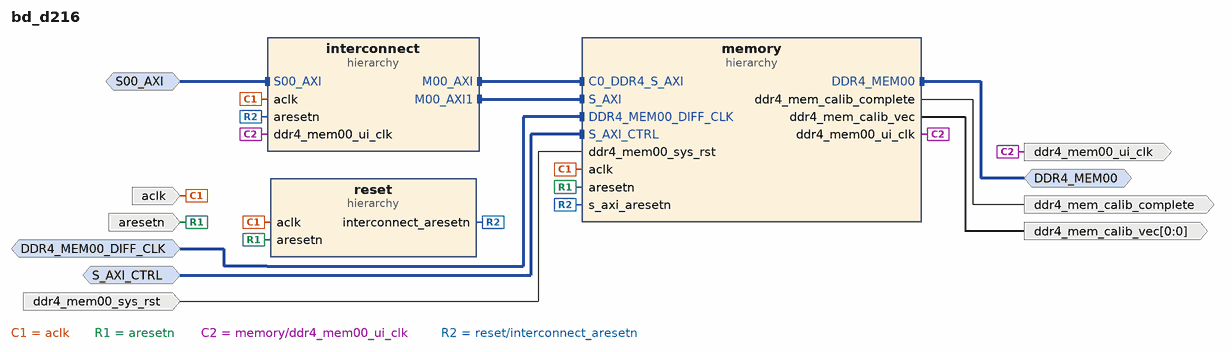
[diagram p0: block diagram of the top level]
# Vivado block design bd_d216, xcku15p-ffva1156-2LV-e, Vivado 2021.1
create_bd_design bd_d216

create_bd_intf_port -mode Slave -vlnv xilinx.com:interface:aximm_rtl:1.0 S_AXI_CTRL
set_property -dict {CONFIG.PROTOCOL AXI4LITE} [get_bd_intf_ports S_AXI_CTRL]
create_bd_intf_port -mode Slave -vlnv xilinx.com:interface:aximm_rtl:1.0 S00_AXI
set_property -dict [list \
  CONFIG.ADDR_WIDTH 35 \
  CONFIG.NUM_READ_OUTSTANDING 2 \
  CONFIG.NUM_WRITE_OUTSTANDING 2 \
  CONFIG.master_id 1 \
] [get_bd_intf_ports S00_AXI]
create_bd_intf_port -mode Master -vlnv xilinx.com:interface:ddr4_rtl:1.0 DDR4_MEM00
create_bd_intf_port -mode Slave -vlnv xilinx.com:interface:diff_clock_rtl:1.0 DDR4_MEM00_DIFF_CLK
set_property -dict {CONFIG.FREQ_HZ 100000000} [get_bd_intf_ports DDR4_MEM00_DIFF_CLK]
create_bd_port -dir I -type clk aclk
set_property -dict {CONFIG.ASSOCIATED_BUSIF S00_AXI:S_AXI_CTRL} [get_bd_ports aclk]
create_bd_port -dir I -type rst aresetn
create_bd_port -dir O -type clk ddr4_mem00_ui_clk
set_property -dict {CONFIG.FREQ_HZ 300000000} [get_bd_ports ddr4_mem00_ui_clk]
create_bd_port -dir I -type rst ddr4_mem00_sys_rst
set_property -dict {CONFIG.POLARITY ACTIVE_HIGH} [get_bd_ports ddr4_mem00_sys_rst]
create_bd_port -dir O -type data ddr4_mem_calib_complete
create_bd_port -dir O -from 0 -to 0 -type data ddr4_mem_calib_vec

create_bd_cell -type hier reset
create_bd_cell -type hier interconnect
create_bd_cell -type hier memory

# ---- hierarchy /reset ----
current_bd_instance /reset
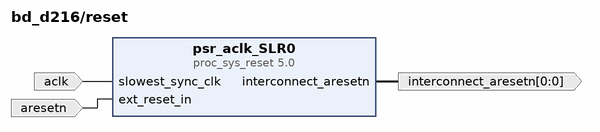
[diagram p1: block diagram inside /reset]
create_bd_pin -dir I -type clk aclk
create_bd_pin -dir I -type rst aresetn
create_bd_pin -dir O -from 0 -to 0 -type rst interconnect_aresetn

create_bd_cell -type ip -vlnv xilinx.com:ip:proc_sys_reset:5.0 psr_aclk_SLR0
set_property -dict {CONFIG.SLR_ASSIGNMENTS SLR0} [get_bd_cells psr_aclk_SLR0]

# ---- hierarchy /interconnect ----
current_bd_instance /interconnect
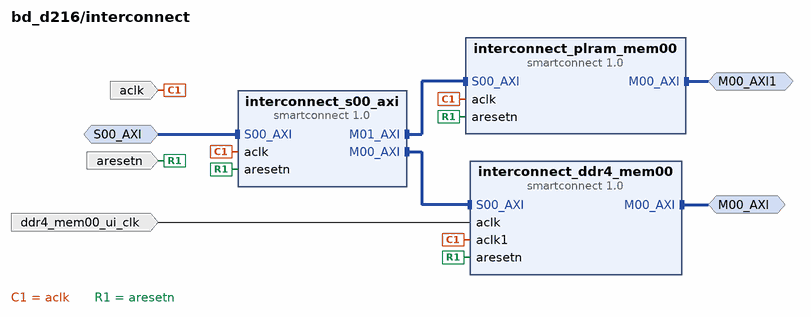
[diagram p2: block diagram inside /interconnect]
create_bd_intf_pin -mode Slave -vlnv xilinx.com:interface:aximm_rtl:1.0 S00_AXI
create_bd_intf_pin -mode Master -vlnv xilinx.com:interface:aximm_rtl:1.0 M00_AXI
create_bd_intf_pin -mode Master -vlnv xilinx.com:interface:aximm_rtl:1.0 M00_AXI1
create_bd_pin -dir I -type clk aclk
create_bd_pin -dir I -type rst aresetn
create_bd_pin -dir I -type clk ddr4_mem00_ui_clk

create_bd_cell -type ip -vlnv xilinx.com:ip:smartconnect:1.0 interconnect_s00_axi
set_property -dict [list \
  CONFIG.ADVANCED_PROPERTIES {__view__ {functional {S00_Buffer {R_SIZE 512 W_SIZE 512} S00_Entry {PKT_R_THR 512 LIM_R_LEN 256 PKT_W_THR 64 LIM_W_LEN 256}}}} \
  CONFIG.NUM_MI 2 \
  CONFIG.NUM_SI 1 \
] [get_bd_cells interconnect_s00_axi]
create_bd_cell -type ip -vlnv xilinx.com:ip:smartconnect:1.0 interconnect_ddr4_mem00
set_property -dict {CONFIG.NUM_CLKS 2 CONFIG.NUM_SI 1} [get_bd_cells interconnect_ddr4_mem00]
create_bd_cell -type ip -vlnv xilinx.com:ip:smartconnect:1.0 interconnect_plram_mem00
set_property -dict {CONFIG.NUM_CLKS 1 CONFIG.NUM_SI 1} [get_bd_cells interconnect_plram_mem00]

# ---- hierarchy /memory ----
current_bd_instance /memory
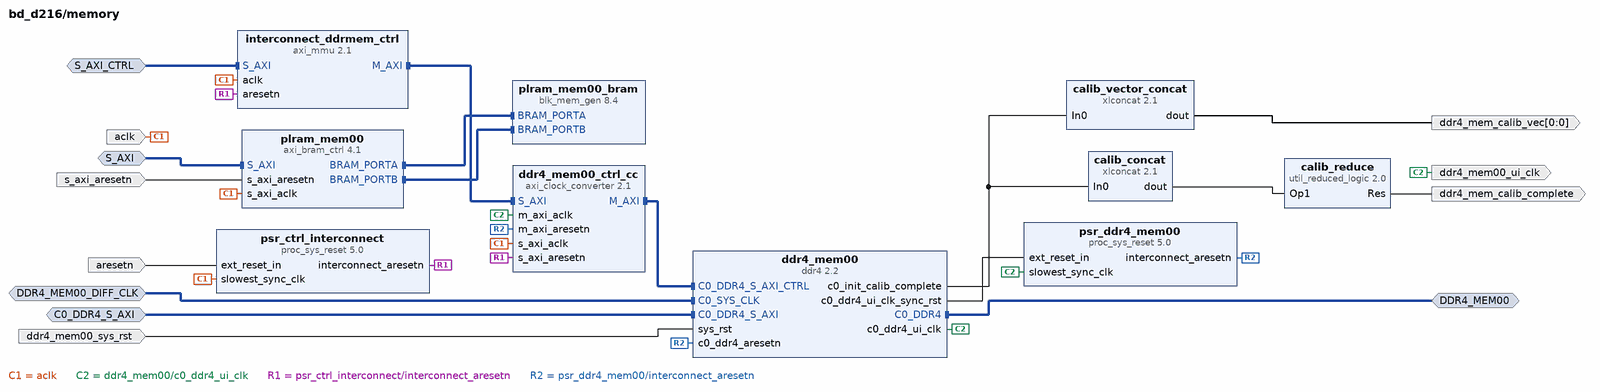
[diagram p3: block diagram inside /memory]
create_bd_intf_pin -mode Slave -vlnv xilinx.com:interface:diff_clock_rtl:1.0 DDR4_MEM00_DIFF_CLK
create_bd_intf_pin -mode Master -vlnv xilinx.com:interface:ddr4_rtl:1.0 DDR4_MEM00
create_bd_intf_pin -mode Slave -vlnv xilinx.com:interface:aximm_rtl:1.0 C0_DDR4_S_AXI
create_bd_intf_pin -mode Slave -vlnv xilinx.com:interface:aximm_rtl:1.0 S_AXI
create_bd_intf_pin -mode Slave -vlnv xilinx.com:interface:aximm_rtl:1.0 S_AXI_CTRL
create_bd_pin -dir O -type clk ddr4_mem00_ui_clk
create_bd_pin -dir I -type rst ddr4_mem00_sys_rst
create_bd_pin -dir I -type clk aclk
create_bd_pin -dir O ddr4_mem_calib_complete
create_bd_pin -dir O -from 0 -to 0 ddr4_mem_calib_vec
create_bd_pin -dir I -type rst s_axi_aresetn
create_bd_pin -dir I -type rst aresetn

create_bd_cell -type ip -vlnv xilinx.com:ip:ddr4:2.2 ddr4_mem00
set_property -dict [list \
  CONFIG.ADDN_UI_CLKOUT1_FREQ_HZ None \
  CONFIG.C0.BANK_GROUP_WIDTH 1 \
  CONFIG.C0.CKE_WIDTH 1 \
  CONFIG.C0.CS_WIDTH 1 \
  CONFIG.C0.DDR4_AUTO_AP_COL_A3 false \
  CONFIG.C0.DDR4_DataMask NO_DM_NO_DBI \
  CONFIG.C0.DDR4_Mem_Add_Map ROW_COLUMN_BANK \
  CONFIG.C0.ODT_WIDTH 1 \
  CONFIG.C0_CLOCK_BOARD_INTERFACE default_300mhz_clk0 \
  CONFIG.C0_DDR4_BOARD_INTERFACE ddr4_sdram_c0 \
  CONFIG.System_Clock Differential \
] [get_bd_cells ddr4_mem00]
create_bd_cell -type ip -vlnv xilinx.com:ip:proc_sys_reset:5.0 psr_ddr4_mem00
create_bd_cell -type ip -vlnv xilinx.com:ip:axi_clock_converter:2.1 ddr4_mem00_ctrl_cc
create_bd_cell -type ip -vlnv xilinx.com:ip:xlconcat:2.1 calib_concat
set_property -dict {CONFIG.NUM_PORTS 1} [get_bd_cells calib_concat]
create_bd_cell -type ip -vlnv xilinx.com:ip:util_reduced_logic:2.0 calib_reduce
set_property -dict {CONFIG.C_OPERATION and CONFIG.C_SIZE 1} [get_bd_cells calib_reduce]
create_bd_cell -type ip -vlnv xilinx.com:ip:xlconcat:2.1 calib_vector_concat
set_property -dict {CONFIG.NUM_PORTS 1} [get_bd_cells calib_vector_concat]
create_bd_cell -type ip -vlnv xilinx.com:ip:axi_bram_ctrl:4.1 plram_mem00
set_property -dict {CONFIG.DATA_WIDTH 512 CONFIG.SLR_ASSIGNMENTS SLR0} [get_bd_cells plram_mem00]
create_bd_cell -type ip -vlnv xilinx.com:ip:blk_mem_gen:8.4 plram_mem00_bram
set_property -dict {CONFIG.Memory_Type True_Dual_Port_RAM CONFIG.SLR_ASSIGNMENTS SLR0} [get_bd_cells plram_mem00_bram]
create_bd_cell -type ip -vlnv xilinx.com:ip:proc_sys_reset:5.0 psr_ctrl_interconnect
create_bd_cell -type ip -vlnv xilinx.com:ip:axi_mmu:2.1 interconnect_ddrmem_ctrl

# ---- connections ----

current_bd_instance /reset
connect_bd_net [get_bd_pins aclk] [get_bd_pins psr_aclk_SLR0/slowest_sync_clk]
connect_bd_net [get_bd_pins aresetn] [get_bd_pins psr_aclk_SLR0/ext_reset_in]
connect_bd_net [get_bd_pins psr_aclk_SLR0/interconnect_aresetn] [get_bd_pins interconnect_aresetn]

current_bd_instance /interconnect
connect_bd_intf_net [get_bd_intf_pins S00_AXI] [get_bd_intf_pins interconnect_s00_axi/S00_AXI]
connect_bd_intf_net [get_bd_intf_pins M00_AXI] [get_bd_intf_pins interconnect_ddr4_mem00/M00_AXI]
connect_bd_intf_net [get_bd_intf_pins M00_AXI1] [get_bd_intf_pins interconnect_plram_mem00/M00_AXI]
connect_bd_intf_net [get_bd_intf_pins interconnect_s00_axi/M00_AXI] [get_bd_intf_pins interconnect_ddr4_mem00/S00_AXI]
connect_bd_intf_net [get_bd_intf_pins interconnect_s00_axi/M01_AXI] [get_bd_intf_pins interconnect_plram_mem00/S00_AXI]
connect_bd_net [get_bd_pins aclk] \
  [get_bd_pins interconnect_ddr4_mem00/aclk1] [get_bd_pins interconnect_plram_mem00/aclk] \
  [get_bd_pins interconnect_s00_axi/aclk]
connect_bd_net -net ddr4_mem00_c0_ddr4_ui_clk [get_bd_pins ddr4_mem00_ui_clk] [get_bd_pins interconnect_ddr4_mem00/aclk]
connect_bd_net -net psr_aclk_SLR0_interconnect_aresetn [get_bd_pins aresetn] \
  [get_bd_pins interconnect_ddr4_mem00/aresetn] [get_bd_pins interconnect_plram_mem00/aresetn] \
  [get_bd_pins interconnect_s00_axi/aresetn]

current_bd_instance /memory
connect_bd_intf_net [get_bd_intf_pins DDR4_MEM00_DIFF_CLK] [get_bd_intf_pins ddr4_mem00/C0_SYS_CLK]
connect_bd_intf_net [get_bd_intf_pins S_AXI_CTRL] [get_bd_intf_pins interconnect_ddrmem_ctrl/S_AXI]
connect_bd_intf_net [get_bd_intf_pins DDR4_MEM00] [get_bd_intf_pins ddr4_mem00/C0_DDR4]
connect_bd_intf_net [get_bd_intf_pins ddr4_mem00_ctrl_cc/M_AXI] [get_bd_intf_pins ddr4_mem00/C0_DDR4_S_AXI_CTRL]
connect_bd_intf_net -intf_net interconnect_DDR4_MEM00_M00_AXI [get_bd_intf_pins C0_DDR4_S_AXI] [get_bd_intf_pins ddr4_mem00/C0_DDR4_S_AXI]
connect_bd_intf_net -intf_net interconnect_PLRAM_MEM00_M00_AXI [get_bd_intf_pins S_AXI] [get_bd_intf_pins plram_mem00/S_AXI]
connect_bd_intf_net [get_bd_intf_pins interconnect_ddrmem_ctrl/M_AXI] [get_bd_intf_pins ddr4_mem00_ctrl_cc/S_AXI]
connect_bd_intf_net [get_bd_intf_pins plram_mem00_bram/BRAM_PORTA] [get_bd_intf_pins plram_mem00/BRAM_PORTA]
connect_bd_intf_net [get_bd_intf_pins plram_mem00_bram/BRAM_PORTB] [get_bd_intf_pins plram_mem00/BRAM_PORTB]
connect_bd_net [get_bd_pins aclk] \
  [get_bd_pins plram_mem00/s_axi_aclk] [get_bd_pins psr_ctrl_interconnect/slowest_sync_clk] \
  [get_bd_pins interconnect_ddrmem_ctrl/aclk] [get_bd_pins ddr4_mem00_ctrl_cc/s_axi_aclk]
connect_bd_net [get_bd_pins aresetn] [get_bd_pins psr_ctrl_interconnect/ext_reset_in]
connect_bd_net [get_bd_pins calib_concat/dout] [get_bd_pins calib_reduce/Op1]
connect_bd_net [get_bd_pins calib_reduce/Res] [get_bd_pins ddr4_mem_calib_complete]
connect_bd_net [get_bd_pins calib_vector_concat/dout] [get_bd_pins ddr4_mem_calib_vec]
connect_bd_net [get_bd_pins ddr4_mem00/c0_ddr4_ui_clk] \
  [get_bd_pins ddr4_mem00_ui_clk] [get_bd_pins psr_ddr4_mem00/slowest_sync_clk] [get_bd_pins ddr4_mem00_ctrl_cc/m_axi_aclk]
connect_bd_net [get_bd_pins ddr4_mem00/c0_ddr4_ui_clk_sync_rst] [get_bd_pins psr_ddr4_mem00/ext_reset_in]
connect_bd_net [get_bd_pins ddr4_mem00/c0_init_calib_complete] [get_bd_pins calib_concat/In0] [get_bd_pins calib_vector_concat/In0]
connect_bd_net [get_bd_pins ddr4_mem00_sys_rst] [get_bd_pins ddr4_mem00/sys_rst]
connect_bd_net -net psr_aclk_SLR0_interconnect_aresetn [get_bd_pins s_axi_aresetn] [get_bd_pins plram_mem00/s_axi_aresetn]
connect_bd_net [get_bd_pins psr_ctrl_interconnect/interconnect_aresetn] \
  [get_bd_pins ddr4_mem00_ctrl_cc/s_axi_aresetn] [get_bd_pins interconnect_ddrmem_ctrl/aresetn]
connect_bd_net [get_bd_pins psr_ddr4_mem00/interconnect_aresetn] \
  [get_bd_pins ddr4_mem00/c0_ddr4_aresetn] [get_bd_pins ddr4_mem00_ctrl_cc/m_axi_aresetn]

current_bd_instance /
connect_bd_intf_net [get_bd_intf_ports DDR4_MEM00_DIFF_CLK] [get_bd_intf_pins memory/DDR4_MEM00_DIFF_CLK]
connect_bd_intf_net [get_bd_intf_ports S00_AXI] [get_bd_intf_pins interconnect/S00_AXI]
connect_bd_intf_net [get_bd_intf_ports S_AXI_CTRL] [get_bd_intf_pins memory/S_AXI_CTRL]
connect_bd_intf_net -intf_net ddr4_mem00_C0_DDR4 [get_bd_intf_ports DDR4_MEM00] [get_bd_intf_pins memory/DDR4_MEM00]
connect_bd_intf_net -intf_net interconnect_DDR4_MEM00_M00_AXI [get_bd_intf_pins interconnect/M00_AXI] [get_bd_intf_pins memory/C0_DDR4_S_AXI]
connect_bd_intf_net -intf_net interconnect_PLRAM_MEM00_M00_AXI [get_bd_intf_pins interconnect/M00_AXI1] [get_bd_intf_pins memory/S_AXI]
connect_bd_net [get_bd_ports aclk] [get_bd_pins reset/aclk] [get_bd_pins interconnect/aclk] [get_bd_pins memory/aclk]
connect_bd_net [get_bd_ports aresetn] [get_bd_pins reset/aresetn] [get_bd_pins memory/aresetn]
connect_bd_net -net calib_reduce_Res [get_bd_pins memory/ddr4_mem_calib_complete] [get_bd_ports ddr4_mem_calib_complete]
connect_bd_net -net calib_vector_concat_dout [get_bd_pins memory/ddr4_mem_calib_vec] [get_bd_ports ddr4_mem_calib_vec]
connect_bd_net -net ddr4_mem00_c0_ddr4_ui_clk [get_bd_pins memory/ddr4_mem00_ui_clk] \
  [get_bd_ports ddr4_mem00_ui_clk] [get_bd_pins interconnect/ddr4_mem00_ui_clk]
connect_bd_net [get_bd_ports ddr4_mem00_sys_rst] [get_bd_pins memory/ddr4_mem00_sys_rst]
connect_bd_net -net psr_aclk_SLR0_interconnect_aresetn [get_bd_pins reset/interconnect_aresetn] \
  [get_bd_pins interconnect/aresetn] [get_bd_pins memory/s_axi_aresetn]

# ---- address map ----
assign_bd_address -offset 0x076000000 -range 128K -target_address_space [get_bd_addr_spaces S00_AXI] [get_bd_addr_segs memory/plram_mem00/S_AXI/Mem0]
assign_bd_address -offset 0x400000000 -range 4G -target_address_space [get_bd_addr_spaces S00_AXI] [get_bd_addr_segs memory/ddr4_mem00/C0_DDR4_MEMORY_MAP/C0_DDR4_ADDRESS_BLOCK]

validate_bd_design
save_bd_design
